# Altium schematic sheet Power.SchDoc: Power
size A4; DocumentNumber: MB1167; Revision: B.1; SheetNumber: 3; SheetTotal: 17; Project: STM327x6G-EVAL
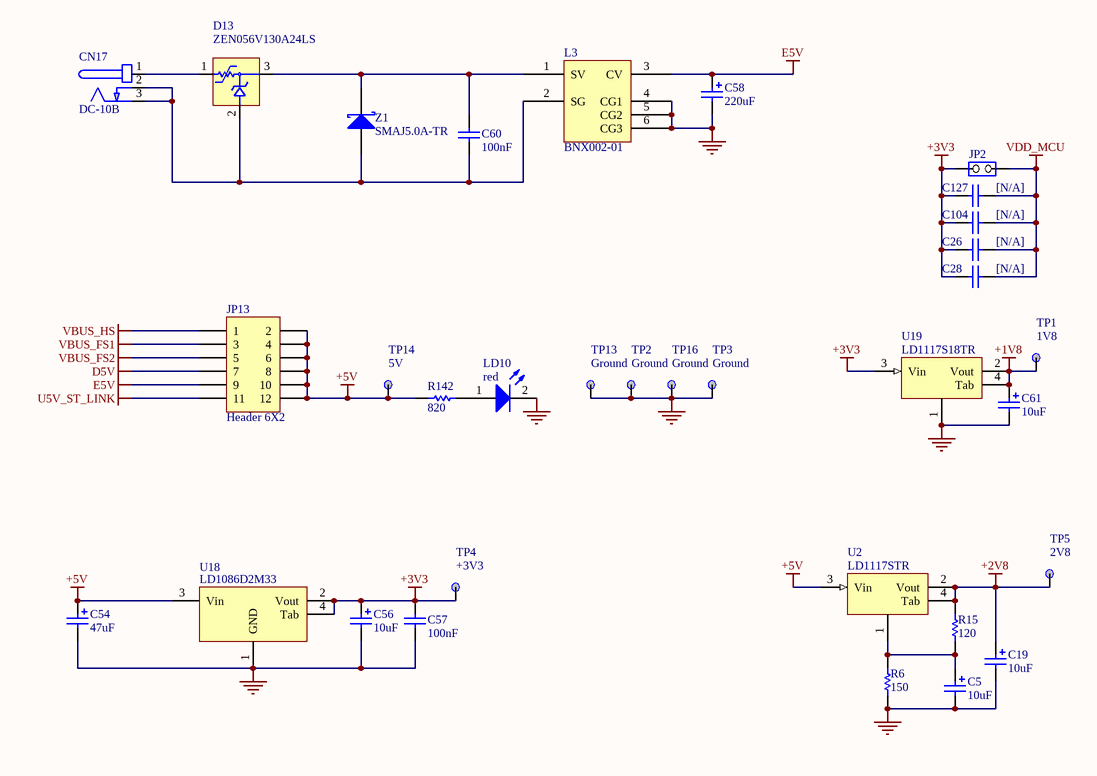
[diagram p0: Power.SchDoc]

## Parts
C5  10uF  [TAN-A]
C19  10uF  [TAN-A]
C26  [N/A]  [0603C]
C28  [N/A]  [0603C]
C54  47uF  [CAE_5R3X5R3_H5R4]
C56  10uF  [TAN-A]
C57  100nF  [0603C]
C58  220uF  [c310m-6]
C60  100nF  [0603C]
C61  10uF  [TAN-A]
C104  [N/A]  [0603C]
C127  [N/A]  [0603C]
CN17  DC-10B  [PWR_JACK_DC10]
D13  ZEN056V130A24LS  [TYCO_ZEN056V130A24LS]
JP2  (no value)  [SIP2]
JP13  Header 6X2  [HDR_2X6_2R54]
L3  BNX002-01  [BNX001]
LD10  red  [0603D]
R6  150  [0603R]
R15  120  [0603R]
R142  820  [0603R]
TP1  1V8  [TP]
TP2  Ground  [TP]
TP3  Ground  [TP]
TP4  +3V3  [TP]
TP5  2V8  [TP]
TP13  Ground  [TP]
TP14  5V  [TP]
TP16  Ground  [TP]
U2  LD1117STR  [SOT-223]
U18  LD1086D2M33  [TO263-3]
U19  LD1117S18TR  [SOT-223]
Z1  SMAJ5.0A-TR  [sma]

## Nets
+1V8: C61.1 TP1.1 U19.2(Vout) U19.4(Tab)
+2V8: C19.1 R15.1 TP5.1 U2.2(Vout) U2.4(Tab)
+3V3: C26.1 C28.1 C56.1 C57.1 C104.1 C127.1 JP2.1(COMMON) TP4.1 U18.2(Vout) U18.4(Tab) U19.3(Vin)
+5V: C54.1 JP13.2 JP13.4 JP13.6 JP13.8 JP13.10 JP13.12 R142.2 TP14.1 U2.3(Vin) U18.3(Vin)
D5V: JP13.7
E5V: C58.1 JP13.9 L3.3(CV)
GND: C5.2 C19.2 C54.2 C56.2 C57.2 C58.2 C61.2 L3.4(CG1) L3.5(CG2) L3.6(CG3) LD10.2(K) R6.2 TP2.1 TP3.1 TP13.1 TP16.1 U18.1(GND) U19.1
U5V_ST_LINK: JP13.11
VBUS_FS1: JP13.3
VBUS_FS2: JP13.5
VBUS_HS: JP13.1
VDD_MCU: C26.2 C28.2 C104.2 C127.2 JP2.2(NO)
NetC5_1: C5.1 R6.1 R15.2 U2.1
NetC60_1: C60.1 D13.3 L3.1(SV) Z1.2(K)
NetC60_2: C60.2 CN17.2(GND) CN17.3(GND) D13.2 L3.2(SG) Z1.1(A)
NetCN17_1: CN17.1(+) D13.1
NetLD10_1: LD10.1(A) R142.1

## Notes on the sheet
- Title:
- Project:
- Size:
- Date:
- A4
- Reference:
- Sheet:
- Revision:
- of

## Library data of the parts
C5 C19 C56 C61 = Cap Pol1: Polarized Capacitor (Radial); Published: 8-Jun-2000; Revision: July-2002: Re-released for DXP Platform.; Publisher: Altium Limited; Value: 10uF
C26 C28 C57 C104 C127 = Cap: Capacitor; Value: 10nF; Published: 8-Jun-2000; Revision: July-2002: Re-released for DXP Platform.; Publisher: Altium Limited
C54 = Cap Pol1: Polarized Capacitor (Radial); Value: 10uF; Published: 8-Jun-2000; Revision: July-2002: Re-released for DXP Platform.; Publisher: Altium Limited
C58 = Cap Pol1: Polarized Capacitor (Radial); Value: 47uF; Published: 8-Jun-2000; Revision: July-2002: Re-released for DXP Platform.; Publisher: Altium Limited
C60 = CAP: Capacitor; Value: 100pF; Published: 8-Jun-2000; Revision: July-2002: Re-released for DXP Platform.; Publisher: Altium Limited
CN17 = PJ202A
JP2 = JP2
JP13 = Header 6X2: Header, 6-Pin, Dual row; Revision: 17-Jul-2002: Re-released for DXP Platform.; Publisher: Altium Limited
L3 = BNX002
LD10 = LED2: Typical RED, GREEN, YELLOW, AMBER GaAs LED; Published: 8-Jun-2000; Revision: July-2002: Re-released for DXP Platform.; Publisher: Altium Limited
R6 R15 R142 = res1: Resistor; Value: 1K; Published: 8-Jun-2000; Revision: July-2002: Re-released for DXP Platform.; Publisher: Altium Limited
TP1-TP5 TP13 TP14 TP16 = TP
U2 U19 = LD1117
U18 = VOLTREG1
Z1 = D Schottky: Schottky Diode; Code - JEDEC: DO-214-AA; Published: 8-Jun-2000; Revision: July-2002: Re-released for DXP Platform.; Publisher: Altium Limited